# Altium project H-bridge.PrjPcb
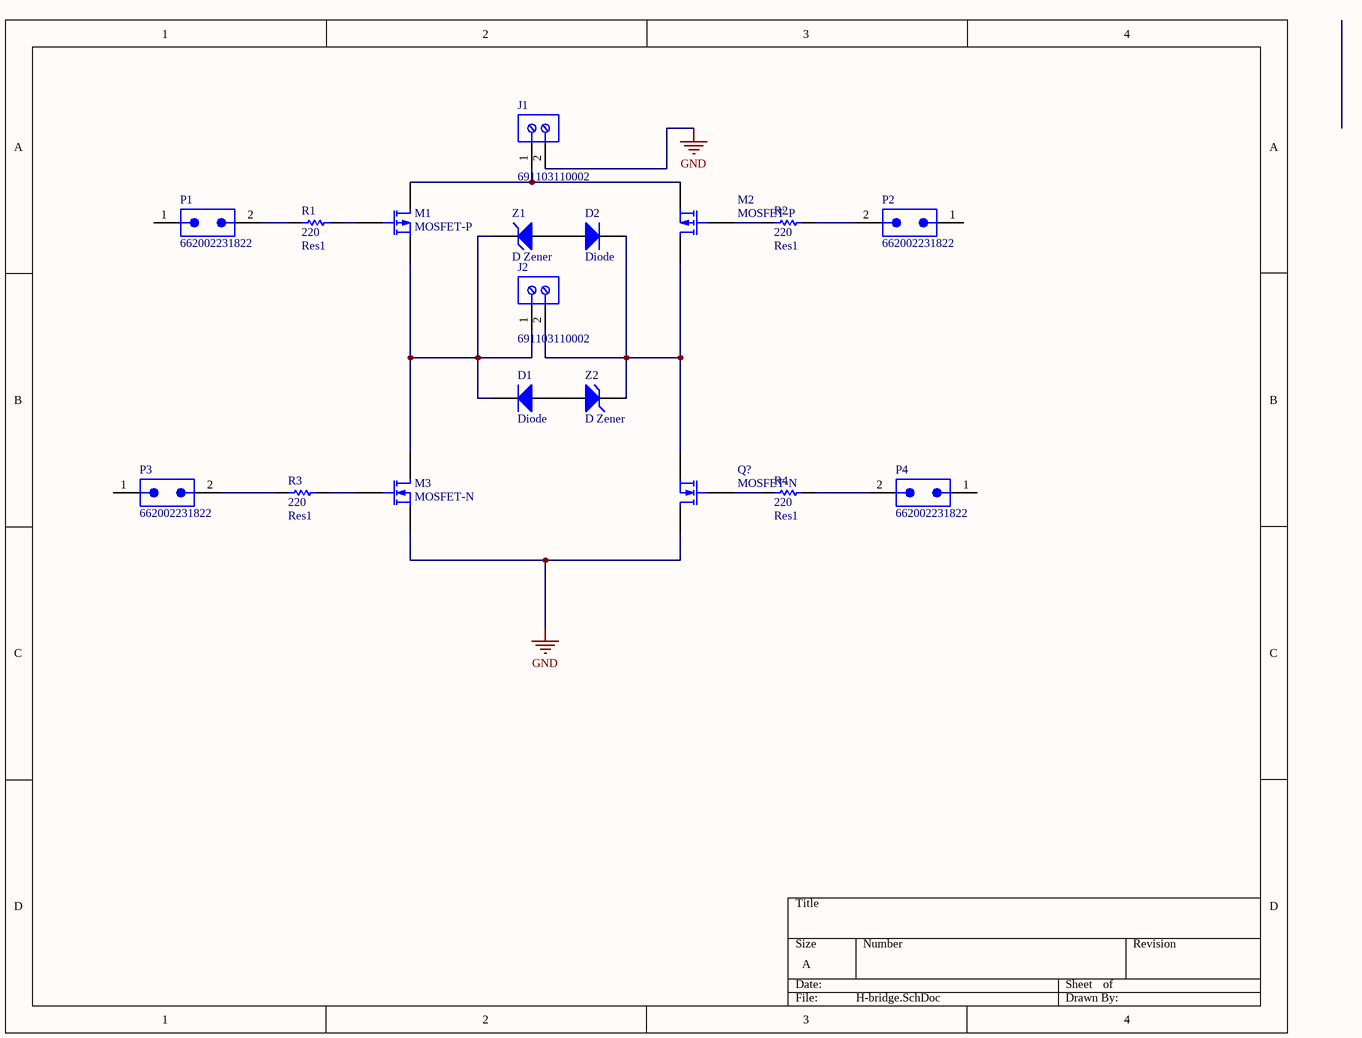
[diagram p0: H-bridge.SchDoc]
1 sheet, 18 parts. Net scope: global (net labels, ports and power ports of the same name join across sheets).
Board file: H-bridge.PcbDoc

## Sheet H-bridge.SchDoc
size A; SheetNumber: 1; SheetTotal: 1; SPICEModelCacheWFCYBHMK: <root> / <DocumentId>WFCYBHMK</DocumentId> / <CacheFrame Number="0"> / <Model Name="zener" Kind="MDL"> / <Text>*ZENER / *Default Zener 10V @ 10mA / *Zener Diode Pinout: A,K / .MODEL ZENER D( BV=10 IBV=10E-3 )</Text> / </Model> / <Model Name="diode" Kind="MDL"> / <Text>*Default Diode / *Diode Pinout: A,K / .MODEL DIODE D()</Text> / </Model> / <Model Name="pmos" Kind="MDL"> / <Text>*Default P-Channel MOSFET / *Pinout: D,G,S / .MODEL PMOS PMOS()</Text> / </Model> / <Model Name="nmos" Kind="MDL"> / <Text>*Default N-Channel MOSFET / *Pinout: D,G,S / .MODEL NMOS NMOS()</Text> / </Model> / </CacheFrame> / </root>

### Parts
D1  Diode  [SMC]
D2  Diode  [SMC]
J1  691103110002  [691103110002]
J2  691103110002  [691103110002]
M1  MOSFET-P  [E3]
M2  MOSFET-P  [E3]
M3  MOSFET-N  [E3]
M4  MOSFET-N  [E3]
P1  662002231822  [662002231822]
P2  662002231822  [662002231822]
P3  662002231822  [662002231822]
P4  662002231822  [662002231822]
R1  Res1  value 220  [AXIAL-0.3]
R2  Res1  R2: 220  [AXIAL-0.3]
R3  Res1  value 220  [AXIAL-0.3]
R4  Res1  value 220  [AXIAL-0.3]
Z1  D Zener  [DIODE-0.7]
Z2  D Zener  [DIODE-0.7]

### Nets
GND: J1.2 M3.3(S) M4.1(D)
NetD1_1: D1.1(A) Z2.1(A)
NetD1_2: D1.2(K) J2.1 M1.3(S) M3.1(D) Z1.2(K)
NetD2_1: D2.1(A) Z1.1(A)
NetD2_2: D2.2(K) J2.2 M2.1(D) M4.3(S) Z2.2(K)
NetJ1_1: J1.1 M1.1(D) M2.3(S)
NetM1_2: M1.2(G) R1.2
NetM2_2: M2.2(G) R2.1
NetM3_2: M3.2(G) R3.2
NetM4_2: M4.2(G) R4.1
NetP1_2: P1.2 R1.1
NetP2_2: P2.2 R2.2
NetP3_2: P3.2 R3.1
NetP4_2: P4.2 R4.2

Not connected (* = marked no-connect by the designer): P1 1; P2 1; P3 1; P4 1

### Library data of the parts
D1 D2 = Diode: Default Diode; Published: 8-Jun-2000; LatestRevisionDate: 17-Jul-2002; LatestRevisionNote: Re-released for DXP Platform.; PackageVersion: Sep-1996; PackageReference: SMC; Publisher: Altium Limited; PackageDescription: DO-214-AB/SMC; 2 C-Bend Leads; Body 7.9 x 5.9 mm, inc. leads (LxW); Code_JEDEC: DO-214-AB
J1 J2 = CMP-1502-03254-2: NexarPartId: 18818286; Pitch: 3.5052mm; Current Rating: 10A; Number of Positions Per Level: 2; Plating: Steel; Number of Levels: 1; Voltage: 125V; Wire/Cable Gauge: 26AWG; Stripping Length: -6mm; Wire Gauge (Min): 16AWG; Packaging: Box; Number of Rows: 1; Color: Blue; Height: 8.5mm; Current: 10A; Lead Pitch: 3.5mm; RoHS: Compliant; Housing Material: Nylon; Width: 8mm; Length: 7mm; Contact Plating: Tin; Number of Pins: 2; Mount: Through Hole; Min Operating Temperature: -40°C; Number of Contacts: 2; REACH SVHC: Unknown; Termination: Screw; Wire Gauge (Max): 26AWG; Max Operating Temperature: 105°C; Voltage Rating: 125V; Contact Material: Brass, Copper, Nickel, Tin, Zinc
M1 M2 = MOSFET-P: P-Channel MOSFET; Published: 8-Jun-2000; LatestRevisionDate: 17-Jul-2002; LatestRevisionNote: Re-released for DXP Platform.; PackageVersion: 1995/1996; PackageReference: E3; Publisher: Altium Limited; PackageDescription: TO, Flat Index; 3 In-Line, Axial Leads; Body Dia. 4.6mm; Lead Dia. 0.5 mm (max)
M3 M4 = MOSFET-N: N-Channel MOSFET; Published: 8-Jun-2000; LatestRevisionDate: 17-Jul-2002; LatestRevisionNote: Re-released for DXP Platform.; PackageVersion: 1995/1996; PackageReference: E3; Publisher: Altium Limited; PackageDescription: TO, Flat Index; 3 In-Line, Axial Leads; Body Dia. 4.6mm; Lead Dia. 0.5 mm (max)
P1-P4 = CMP-1502-00340-2: NexarPartId: 8917600; Contact Resistance: 10mΩ; Connector Type: Male Pin, Socket; Row Spacing: 2.9972mm; Number of Contacts: 2; Gender: Male; Operating Supply Voltage: 250V; Current Rating: 5A; Pitch: 3mm; Insulation Resistance: 1GΩ; Contact Material: Copper; Lead Pitch: 3mm; Mount: Surface Mount; Number of Pins: 2; Max Operating Temperature: 105°C; Contact Plating: Tin; RoHS: Compliant; Color: Black; Width: 6.7mm; Termination: Solder; Fastening Type: Ramp; Number of Rows: 2; Height: 9.9mm; Min Operating Temperature: -40°C; Length: 6.7mm; Orientation: Vertical; REACH SVHC: Unknown; Housing Material: Nylon; Number of Positions: 2
R1-R4 = Res1: Resistor; Published: 8-Jun-2000; LatestRevisionDate: 17-Jul-2002; LatestRevisionNote: Re-released for DXP Platform.; PackageReference: AXIAL-0.3; Publisher: Altium Limited; PackageDescription: Axial Device, Thru-Hole; 2 Leads; 0.3 in Pin Spacing
Z1 Z2 = D Zener: Zener Diode; Published: 8-Jun-2000; LatestRevisionDate: 17-Jul-2002; LatestRevisionNote: Re-released for DXP Platform.; PackageReference: DIODE-0.7; Publisher: Altium Limited; PackageDescription: Diode, Thru-Hole; 2 Leads; 0.7 in Pin Spacing